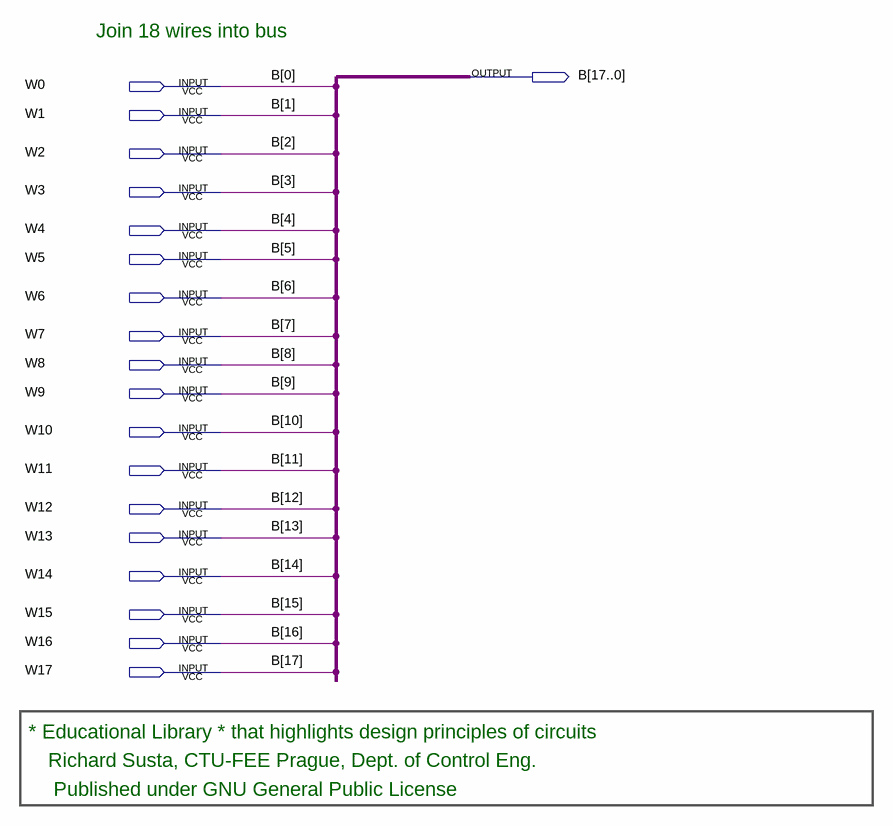
[diagram p0: schematic sheet]
// Quartus schematic join18wires.bdf as structural Verilog: 0 symbols, 19 pins
module join18wires (
  input  W0,
  input  W1,
  input  W2,
  input  W3,
  input  W4,
  input  W5,
  input  W6,
  input  W7,
  input  W8,
  input  W9,
  input  W10,
  input  W11,
  input  W12,
  input  W13,
  input  W14,
  input  W15,
  input  W16,
  input  W17,
  output [17:0] B
);


  assign B = {W17, W16, W15, W14, W13, W12, W11, W10, W9, W8, W7, W6, W5, W4, W3, W2, W1, W0};

  // Notes on the sheet:
  //   Join 18 wires into bus
  //   * Educational Library * that highlights design principles of circuits
  //   Richard Susta, CTU-FEE Prague, Dept. of Control Eng. 
  //    Published under GNU General Public License
endmodule
